# Altium schematic sheet 1_interface.schdoc: Solar Panels
size A4; Engineer: Eng_2_ALT; SheetNumber: 1; SheetTotal: 2; Designed by: Marina Duailibe; Version: v0.1
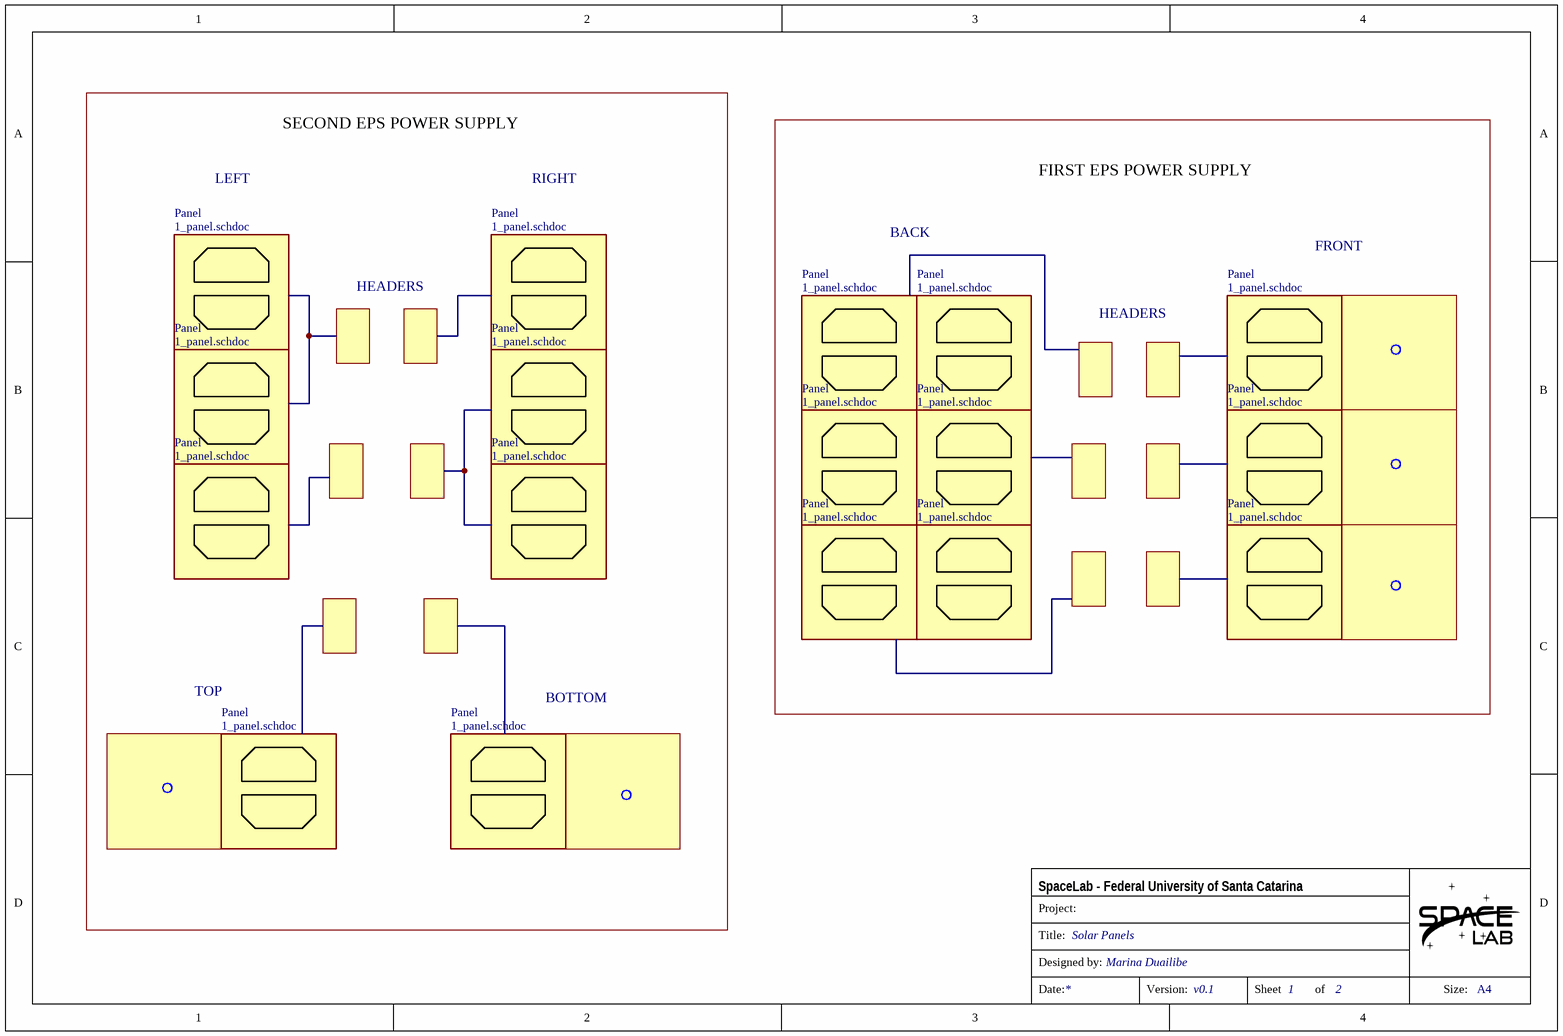
[diagram p0: 1_interface.schdoc]

## Sub-sheets
Panel = 1_panel.schdoc: no entries
Panel = 1_panel.schdoc: no entries
Panel = 1_panel.schdoc: no entries
Panel = 1_panel.schdoc: no entries
Panel = 1_panel.schdoc: no entries
Panel = 1_panel.schdoc: no entries
Panel = 1_panel.schdoc: no entries
Panel = 1_panel.schdoc: no entries
Panel = 1_panel.schdoc: no entries
Panel = 1_panel.schdoc: no entries
Panel = 1_panel.schdoc: no entries
Panel = 1_panel.schdoc: no entries
Panel = 1_panel.schdoc: no entries
Panel = 1_panel.schdoc: no entries
Panel = 1_panel.schdoc: no entries
Panel = 1_panel.schdoc: no entries
Panel = 1_panel.schdoc: no entries

## Notes on the sheet
- SECOND EPS POWER SUPPLY
- FIRST EPS POWER SUPPLY
- LEFT
- RIGHT
- BACK
- FRONT
- HEADERS
- TOP
- BOTTOM
- Project:
- SpaceLab - Federal University of Santa Catarina
- Title:
- Designed by:
- Date:
- Version:
- Sheet
- of
- Size:
- A4